# EAGLE schematic rgbboard (EAGLE 7.3.0)
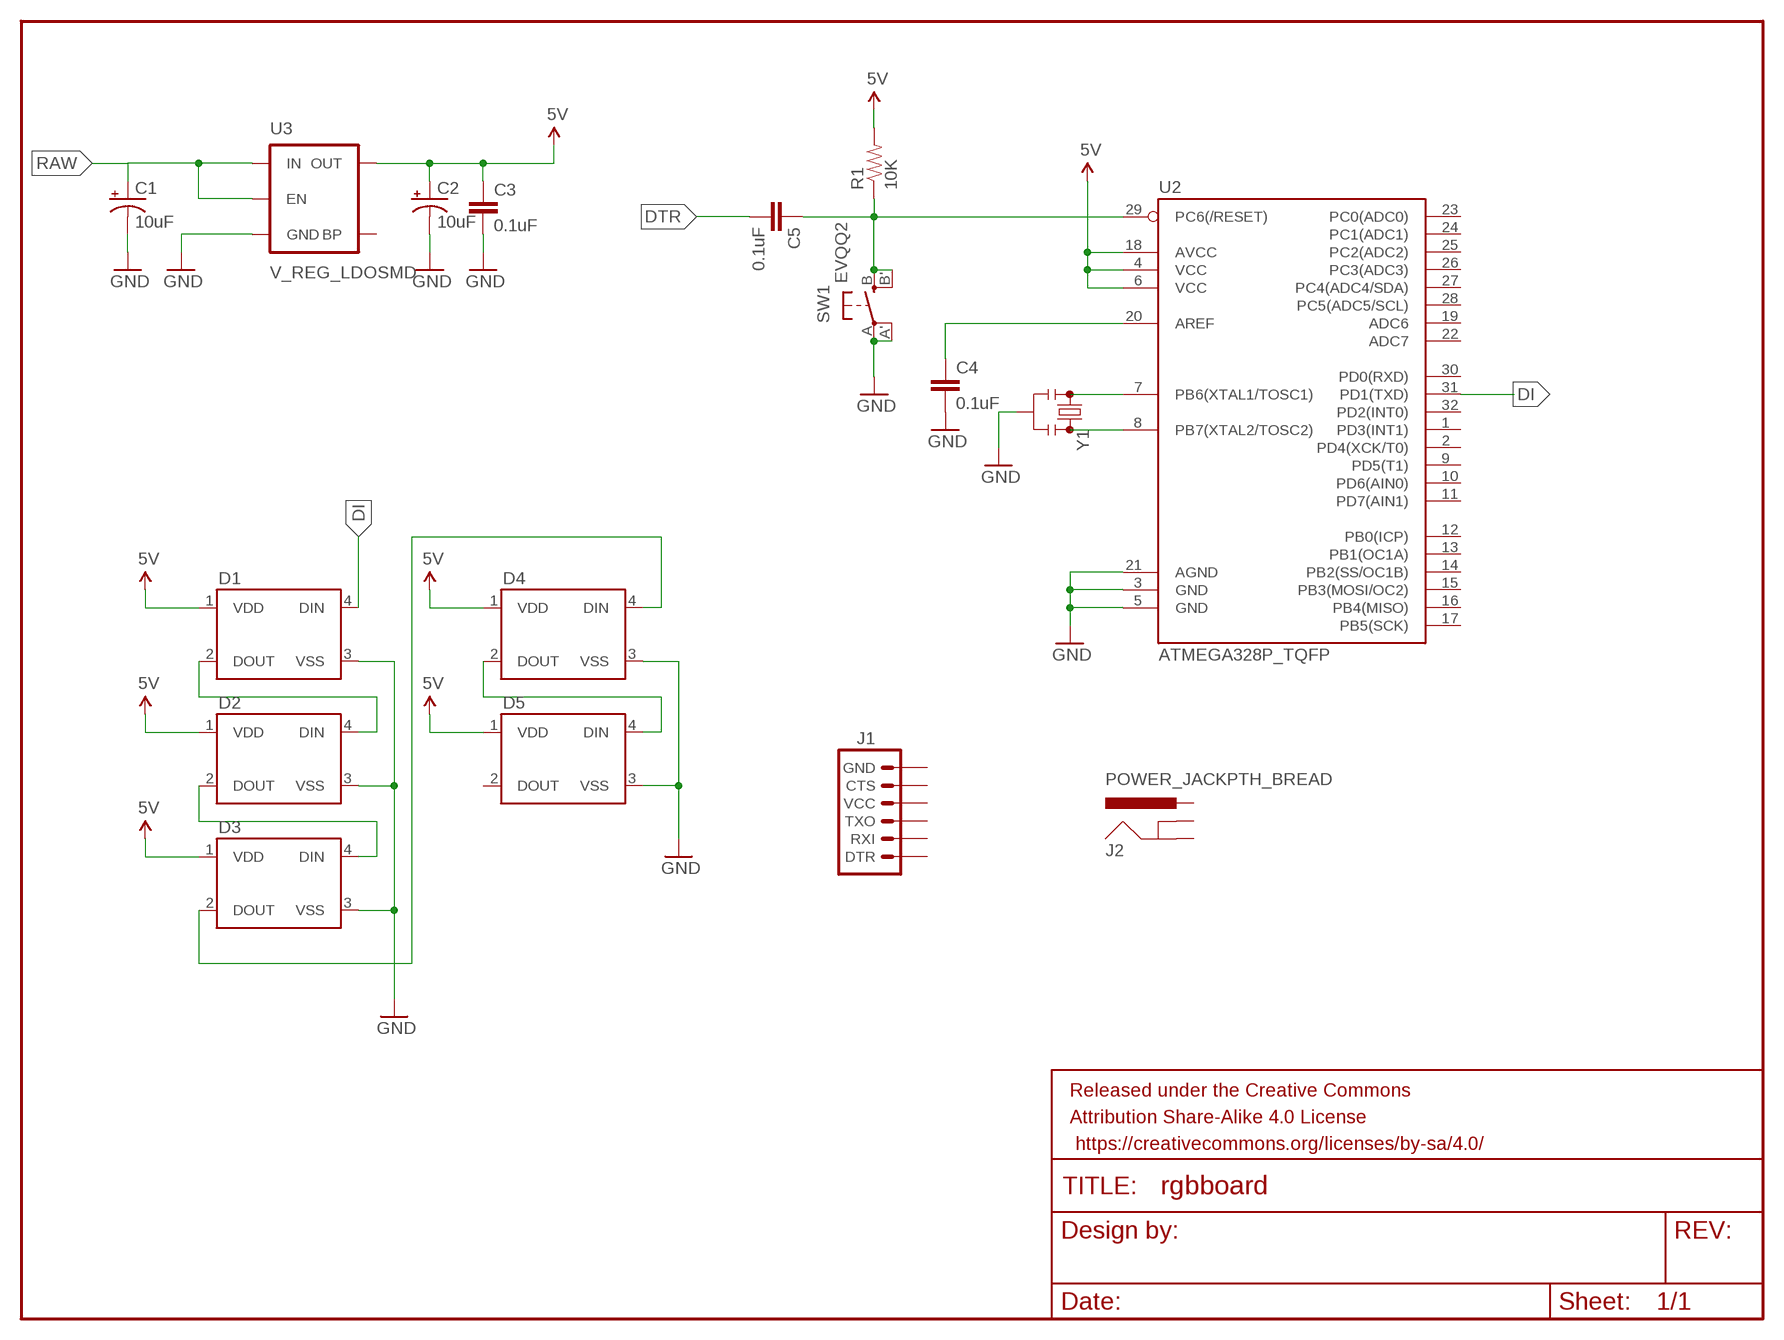
[diagram p0: schematic, sheet 1]

## Parts
C1  10uF  CAP_POL1206  [EIA3216]
C2  10uF  CAP_POL1206  [EIA3216]
C3  0.1uF  CAP0603-CAP  [0603-CAP]
C4  0.1uF  CAP0603-CAP  [0603-CAP]
C5  0.1uF  CAP0603-CAP  [0603-CAP]
D1  WS2812B  [WS2812B]
D2  WS2812B  [WS2812B]
D3  WS2812B  [WS2812B]
D4  WS2812B  [WS2812B]
D5  WS2812B  [WS2812B]
FRAME1  FRAME-LETTER  [CREATIVE_COMMONS]
J1  ARDUINO_SERIAL_PROGRAMPTH  [1X06]
J2  POWER_JACKPTH_BREAD  [POWER_JACK_PTH_BREAD]
R1  10K  RESISTOR0603  [0603-RES]
SW1  EVQQ2  SPST_TACT-EVQQ2  [EVQ-Q2]
U2  ATMEGA328P_TQFP  [TQFP32-08]
U3  V_REG_LDOSMD  [SOT23-5]
Y1  RESONATORPTH  [RESONATOR-PTH]

## Nets
5V: C2.A(+) C3.1 D1.1(VDD) D2.1(VDD) D3.1(VDD) D4.1(VDD) D5.1(VDD) R1.2 U2.4(VCC) U2.6(VCC) U2.18(AVCC) U3.5(OUT)
DI: D1.4(DIN) U2.31(PD1(TXD))
DTR: C5.2
GND: C1.C(-) C2.C(-) C3.2 C4.2 D1.3(VSS) D2.3(VSS) D3.3(VSS) D4.3(VSS) D5.3(VSS) SW1.A'(P1) SW1.A(P) U2.3(GND) U2.5(GND) U2.21(AGND) U3.2(GND) Y1.2
N$1: C4.1 U2.20(AREF)
N$2: D1.2(DOUT) D2.4(DIN)
N$3: D2.2(DOUT) D3.4(DIN)
N$4: D3.2(DOUT) D4.4(DIN)
N$5: D4.2(DOUT) D5.4(DIN)
N$6: U2.7(PB6(XTAL1/TOSC1)) Y1.1
N$7: U2.8(PB7(XTAL2/TOSC2)) Y1.3
N$10: C5.1 R1.1 SW1.B'(S1) SW1.B(S) U2.29(PC6(/RESET))
RAW: C1.A(+) U3.1(IN) U3.3(EN)
Unconnected: D5.2(DOUT) J1.1(DTR) J1.2(RXI) J1.3(TXO) J1.4(VCC) J1.5(CTS) J1.6(GND) J2.GND J2.GNDBREAK J2.PWR U2.1(PD3(INT1)) U2.2(PD4(XCK/T0)) U2.9(PD5(T1)) U2.10(PD6(AIN0)) U2.11(PD7(AIN1)) U2.12(PB0(ICP)) U2.13(PB1(OC1A)) U2.14(PB2(SS/OC1B)) U2.15(PB3(MOSI/OC2)) U2.16(PB4(MISO)) U2.17(PB5(SCK)) U2.19(ADC6) U2.22(ADC7) U2.23(PC0(ADC0)) U2.24(PC1(ADC1)) U2.25(PC2(ADC2)) U2.26(PC3(ADC3)) U2.27(PC4(ADC4/SDA)) U2.28(PC5(ADC5/SCL)) U2.30(PD0(RXD)) U2.32(PD2(INT0)) U3.4(BP)

## Library data of the parts
C1 C2 = SparkFun-Capacitors:CAP_POL: Capacitor Polarized These are standard SMD and PTH capacitors. Normally 10uF, 47uF, and 100uF in electrolytic and tantalum varieties. Always verify the external diameter of the through hole cap, it varies with capacity, voltage, and manufacturer. The EIA devices should be standard.
C3-C5 = SparkFun-Capacitors:CAP: Capacitor Standard 0603 ceramic capacitor, and 0.1" leaded capacitor.
D1-D5 = SparkFun-LED:WS2812B: WS2812B - Intelligent control LED integrated light source Technical Specifications: Power Supply Voltage (VDD): 3.5 to 5.3 V Input Voltage (VI): -0.5 to VDD+0.5 V Operating Junction Temperature (Topt): -25°C to +80°C Storage Temperature Range (Tstg): -55°C to +150°C; PROD_ID: DIO-12503
FRAME1 = SparkFun-Aesthetics:FRAME-LETTER: Schematic Frame Standard 8.5x11 US Letter frame
J1 = SparkFun-Connectors:ARDUINO_SERIAL_PROGRAM: FTDI connector footprints
J2 = SparkFun-Connectors:POWER_JACK: Power Jack This is the standard 5.5mm barrel jack for power. The PTH is the most common, proven, reliable, footprint. The Slot footprint only works if the mill layer is transmitted to the PCB fab house so be warned. Mating wall wart : TOL-00298 (and others); PROD_ID: PRT-10811
R1 = SparkFun-Resistors:RESISTOR: Resistor Basic schematic elements and footprints for 0603, 1206, and PTH resistors.
SW1 = adafruit:SPST_TACT: SMT 6mm switch, EVQQ2 series http://www.ladyada.net/library/eagle
U2 = SparkFun-DigitalIC:ATMEGA328P_TQFP; PROD_ID: IC-09069
U3 = SparkFun-PowerIC:V_REG_LDO: Voltage Regulator LDO Standard 150mA LDO voltage regulator in SOT-23 layout. Micrel part MIC5205. BP (by-pass) pin is used to lower output noise with 470pF cap.
Y1 = SparkFun-FreqCtrl:RESONATOR: Resonator Small SMD resonator. Used, eg, on the Arduino Pro/ Pro Mini boards. 8MHz- XTAL-08895 16MHz- XTAL-08900